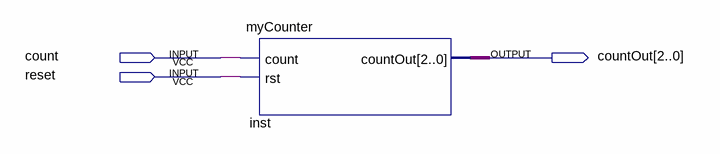
[diagram p0: schematic sheet]
// Quartus schematic Counter.bdf as structural Verilog: 1 symbols, 3 pins
module Counter (
  input  count,
  input  reset,
  output [2:0] countOut
);

  myCounter inst (.count(count), .rst(reset), .countOut(countOut));
endmodule
